# EAGLE design Robot v4 (EAGLE 9.2.1)
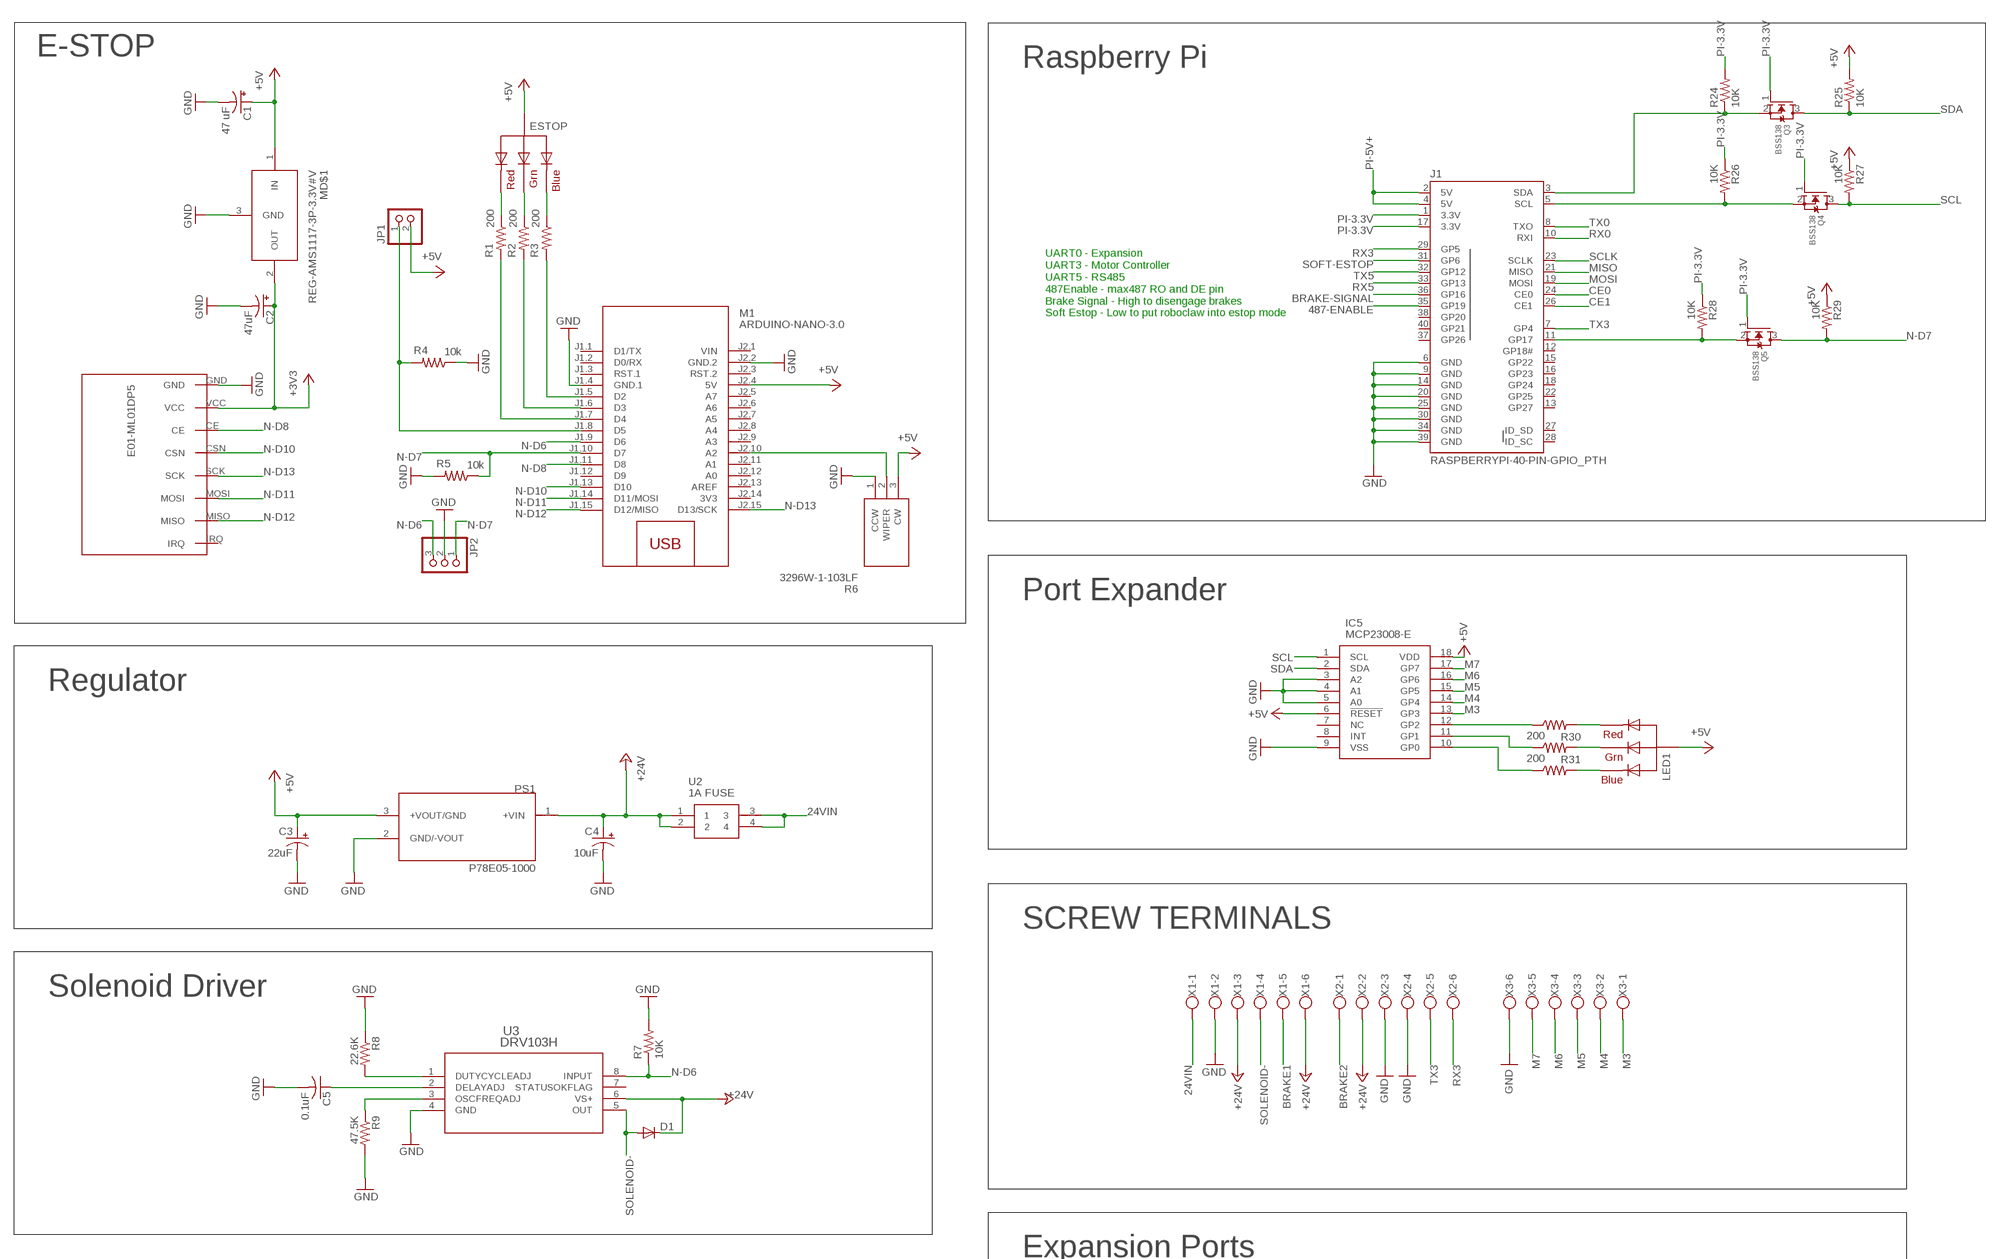
[diagram p0: schematic, sheet 1, part 1 of 2]
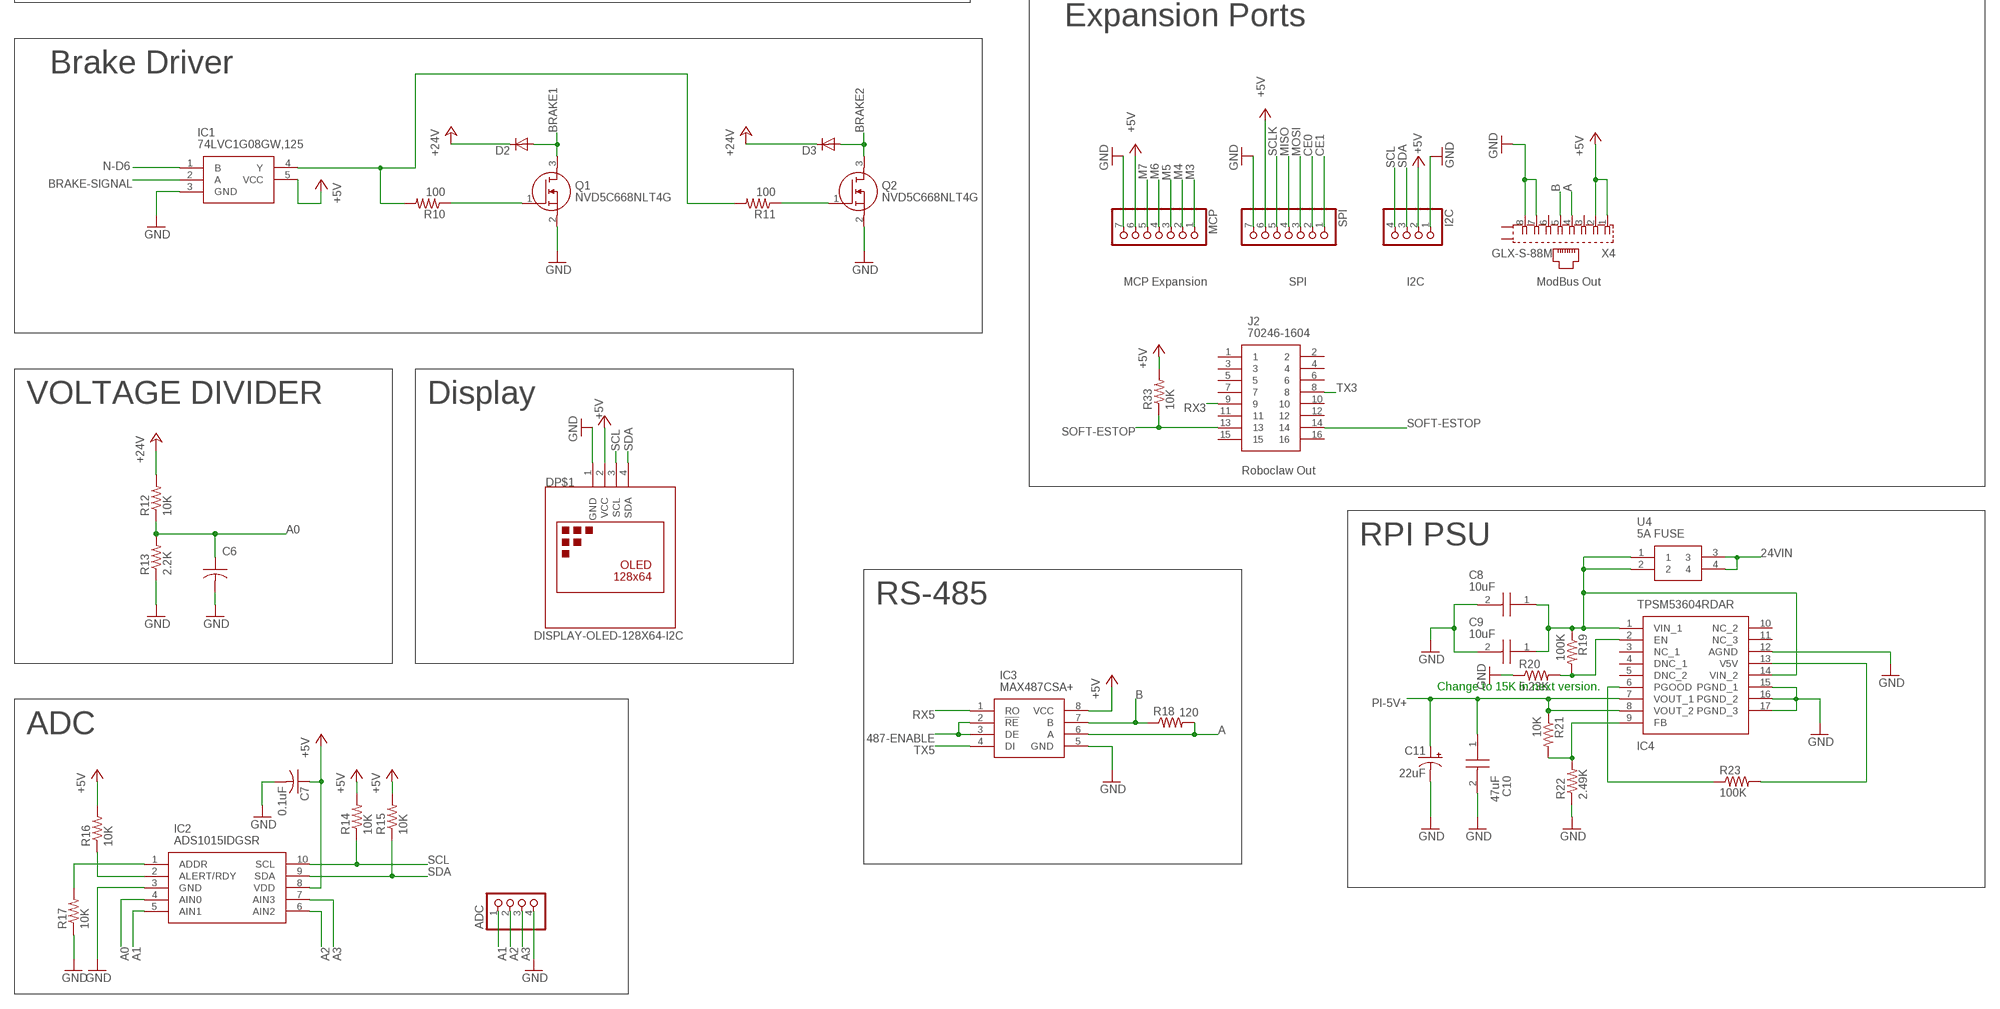
[diagram p1: schematic, sheet 1, part 2 of 2]

## Parts
ADC  PINHD-1X4  [1X04]
C1  47 uF  CPOL-USE2.5-5  [E2,5-5]
C2  47uF  CPOL-USE2.5-5  [E2,5-5]
C3  22uF  CPOL-USE3.5-8  [E3,5-8]
C4  10uF  CPOL-USE3.5-8  [E3,5-8]
C5  0.1uF  C-USC0805  [C0805]
C6  0.01uF  C-USC0805  [C0805]
C7  0.1uF  C-USC0805  [C0805]
C8  10uF  GRT31CR61H106ME01L  [CAPC3216X180N]
C9  10uF  GRT31CR61H106ME01L  [CAPC3216X180N]
C10  47uF  GRM21BR61A476ME15L  [CAPC2012X145N]
C11  22uF  CPOL-USE3.5-8  [E3,5-8]
D1  DIODESOD-123  [SOD-123]
D2  DIODESOD-123  [SOD-123]
D3  DIODESOD-123  [SOD-123]
DP$1  DISPLAY-OLED-128X64-I2C  [DISPLAY-OLED-128X64-I2C]
ESTOP  RGBLED_CA-5MM  [LED5MMRGB]
I2C  PINHD-1X4  [1X04]
IC1  74LVC1G08GW,125  [SOT65P212X110-5N]
IC2  ADS1015IDGSR  [SOP50P490X110-10N]
IC3  MAX487CSA+  [SOIC127P600X175-8N]
IC4  TPSM53604RDAR  [TPSM53604RDAR]
IC5  MCP23008-E  MCP23008-E_SO  [SOIC127P1030X265-18N]
J1  RASPBERRYPI-40-PIN-GPIO_PTH  [2X20_SHROUDED]
J2  70246-1604  [SHDR16W64P254_2X8_2794X889X947]
JP1  PINHD-1X2  [1X02]
JP2  PINHD-1X3  [1X03]
LED1  RGBLED_CA-5MM  [LED5MMRGB]
M1  ARDUINO-NANO-3.0  [ARDUINO-NANO-3.0]
MCP  PINHD-1X7  [1X07]
MD$1  REG-AMS1117-3P-3.3V#V  [REG-AMS1117-3P#V]
MD$2  E01-ML01DP5  [E01-ML01DP5]
PS1  P78E05-1000  [CONV_P78E05-1000]
Q1  NVD5C668NLT4G  [DPAK_(SINGLE-GAUGE)_TO-252(369]
Q2  NVD5C668NLT4G  [DPAK_(SINGLE-GAUGE)_TO-252(369]
Q3  BSS138  MOSFET-NREFLOW  [SOT23]
Q4  BSS138  MOSFET-NREFLOW  [SOT23]
Q5  BSS138  MOSFET-NREFLOW  [SOT23]
R1  200  R-US_M0805  [M0805]
R2  200  R-US_M0805  [M0805]
R3  200  R-US_M0805  [M0805]
R4  10k  R-US_M0805  [M0805]
R5  10k  R-US_M0805  [M0805]
R6  3296W-1-103LF  [SHDR3W54P0X254_1X3_953X483X115]
R7  10K  R-US_M0805  [M0805]
R8  22.6K  R-US_M0805  [M0805]
R9  47.5K  R-US_M0805  [M0805]
R10  100  R-US_M0805  [M0805]
R11  100  R-US_M0805  [M0805]
R12  10K  R-US_M0805  [M0805]
R13  2.2K  R-US_M0805  [M0805]
R14  10K  R-US_R0805  [R0805]
R15  10K  R-US_R0805  [R0805]
R16  10K  R-US_R0805  [R0805]
R17  10K  R-US_R0805  [R0805]
R18  120  R-US_R0805  [R0805]
R19  100K  R-US_R0805  [R0805]
R20  5.23K  R-US_R0805  [R0805]
R21  10K  R-US_R0805  [R0805]
R22  2.49K  R-US_R0805  [R0805]
R23  100K  R-US_R0805  [R0805]
R24  10K  R-US_R0805  [R0805]
R25  10K  R-US_R0805  [R0805]
R26  10K  R-US_R0805  [R0805]
R27  10K  R-US_R0805  [R0805]
R28  10K  R-US_R0805  [R0805]
R29  10K  R-US_R0805  [R0805]
R30  200  R-US_M0805  [M0805]
R31  200  R-US_M0805  [M0805]
R32  200  R-US_M0805  [M0805]
R33  10K  R-US_R0805  [R0805]
SPI  PINHD-1X7  [1X07]
U2  1A FUSE  3568  [3568]
U3  DRV103H  [DDA8]
U4  5A FUSE  3568  [3568]
X1  W237-136  [W237-136]
X2  W237-136  [W237-136]
X3  W237-136  [W237-136]
X4  GLX-S-88M  [GLX-S-88M]

## Nets
24VIN: U2.3 U2.4 U4.3 U4.4 X1.1
487-ENABLE: IC3.2(!RE) IC3.3(DE) J1.35(GP19)
+3V3: C2.+ MD$1.2(OUT) MD$2.VCC
+5V: C1.+ C3.+ C7.1 DP$1.2(VCC) ESTOP.2(VCC) I2C.2 IC1.5(VCC) IC2.8(VDD) IC3.8(VCC) IC5.6(!RESET) IC5.18(VDD) JP1.2 LED1.2(VCC) M1.J2.4(5V) MCP.6 MD$1.1(IN) PS1.3(+VOUT/GND) R6.3(CW) R14.2 R15.2 R16.2 R25.2 R27.1 R29.1 R33.2 SPI.6 X4.1 X4.2
+24V [Power]: C4.+ D1.C D2.C D3.C PS1.1(+VIN) R12.2 U2.1 U2.2 U3.6(VS+) X1.3 X1.6 X2.2
A: IC3.6(A) R18.2 X4.4
A0: C6.1 IC2.4(AIN0) R12.1 R13.2
A1: ADC.1 IC2.5(AIN1)
A2: ADC.2 IC2.6(AIN2)
A3: ADC.3 IC2.7(AIN3)
B: IC3.7(B) R18.1 X4.5
BRAKE1 [Power]: D2.A Q1.3(D) X1.5
BRAKE2 [Power]: D3.A Q2.3(D) X2.1
BRAKE-SIGNAL: IC1.2(A) J1.36(GP16)
CE0: J1.24(CE0) SPI.2
CE1: J1.26(CE1) SPI.1
GND: ADC.4 C1.- C2.- C3.- C4.- C5.2 C6.2 C7.2 C8.2 C9.2 C10.2 C11.- DP$1.1(GND) I2C.1 IC1.3(GND) IC2.3(GND) IC3.5(GND) IC4.12(AGND) IC4.15(PGND_1) IC4.16(PGND_2) IC4.17(PGND_3) IC5.3(A2) IC5.4(A1) IC5.5(A0) IC5.9(VSS) J1.6(GND) J1.9(GND) J1.14(GND) J1.20(GND) J1.25(GND) J1.30(GND) J1.34(GND) J1.39(GND) JP2.2 M1.J1.4(GND.1) M1.J2.2(GND.2) MCP.7 MD$1.3(GND) MD$2.GND PS1.2(GND/-VOUT) Q1.2(S) Q2.2(S) R4.1 R5.2 R6.1(CCW) R7.2 R8.1 R9.2 R13.1 R17.1 R20.1 R22.1 SPI.7 U3.4(GND) X1.2 X2.3 X2.4 X3.6 X4.7 X4.8
M3: IC5.13(GP3) MCP.1 X3.1
M4: IC5.14(GP4) MCP.2 X3.2
M5: IC5.15(GP5) MCP.3 X3.3
M6: IC5.16(GP6) MCP.4 X3.4
M7: IC5.17(GP7) MCP.5 X3.5
MISO: J1.21(MISO) SPI.4
MOSI: J1.19(MOSI) SPI.3
N$2: IC5.12(GP2) R30.1
N$3: IC5.11(GP1) R31.1
N$4 [Power]: C8.1 C9.1 IC4.1(VIN_1) IC4.14(VIN_2) R19.1 U4.1 U4.2
N$5: IC1.4(Y) R10.2 R11.2
N$6: J1.5(SCL) Q4.2(S) R26.2
N$7: Q2.1(G) R11.1
N$8: Q1.1(G) R10.1
N$9: J1.3(SDA) Q3.2(S) R24.1
N$12: IC5.10(GP0) R32.1
N$13: IC4.2(EN) R19.2 R20.2
N$14: IC4.9(FB) R21.2 R22.2
N$15: J1.11(GP17) Q5.2(S) R28.2
N$16: IC4.13(V5V) R23.2
N$17: IC4.6(PGOOD) R23.1
N$20: IC2.2(ALERT/RDY) R16.1
N$21: IC2.1(ADDR) R17.2
N$34: LED1.1(RED) R30.2
N$35: LED1.3(GREEN) R31.2
N$36: LED1.4(BLUE) R32.2
N$37: ESTOP.4(BLUE) R3.1
N$38: ESTOP.3(GREEN) R2.1
N$39: ESTOP.1(RED) R1.1
N$40: M1.J1.5(D2) R3.2
N$41: JP1.1 M1.J1.8(D5) R4.2
N$42: M1.J1.6(D3) R2.2
N$43: M1.J1.7(D4) R1.2
N$44: M1.J2.10(A2) R6.2(WIPER)
N$53: C5.1 U3.2(DELAYADJ)
N$55: R9.1 U3.3(OSCFREQADJ)
N$57: R8.2 U3.1(DUTYCYCLEADJ)
N-D6: IC1.1(B) JP2.3 M1.J1.9(D6) R7.1 U3.8(INPUT)
N-D7: JP2.1 M1.J1.10(D7) Q5.3(D) R5.1 R29.2
N-D8: M1.J1.11(D8) MD$2.CE
N-D10: M1.J1.13(D10) MD$2.CSN
N-D11: M1.J1.14(D11/MOSI) MD$2.MOSI
N-D12: M1.J1.15(D12/MISO) MD$2.MISO
N-D13: M1.J2.15(D13/SCK) MD$2.SCK
PI-3.3V: J1.1(3.3V) J1.17(3.3V) Q3.1(G) Q4.1(G) Q5.1(G) R24.2 R26.1 R28.1
PI-5V+: C10.1 C11.+ IC4.7(VOUT_1) IC4.8(VOUT_2) J1.2(5V) J1.4(5V) R21.1
RX0: J1.10(RXI)
RX3: J1.29(GP5) J2.9 X2.6
RX5: IC3.1(RO) J1.33(GP13)
SCL: DP$1.3(SCL) I2C.4 IC2.10(SCL) IC5.1(SCL) Q4.3(D) R14.1 R27.2
SCLK: J1.23(SCLK) SPI.5
SDA: DP$1.4(SDA) I2C.3 IC2.9(SDA) IC5.2(SDA) Q3.3(D) R15.1 R25.1
SOFT-ESTOP: J1.31(GP6) J2.13 J2.14 R33.1
SOLENOID- [Power]: D1.A U3.5(OUT) X1.4
TX0: J1.8(TXO)
TX3: J1.7(GP4) J2.8 X2.5
TX5: IC3.4(DI) J1.32(GP12)
Unconnected: IC4.3(NC_1) IC4.4(DNC_1) IC4.5(DNC_2) IC4.10(NC_2) IC4.11(NC_3) IC5.7(NC) IC5.8(INT) J1.12(GP18#) J1.13(GP27) J1.15(GP22) J1.16(GP23) J1.18(GP24) J1.22(GP25) J1.27(ID_SD) J1.28(ID_SC) J1.37(GP26) J1.38(GP20) J1.40(GP21) J2.1 J2.2 J2.3 J2.4 J2.5 J2.6 J2.7 J2.10 J2.11 J2.12 J2.15 J2.16 M1.J1.1(D1/TX) M1.J1.2(D0/RX) M1.J1.3(RST.1) M1.J1.12(D9) M1.J2.3(RST.2) M1.J2.5(A7) M1.J2.6(A6) M1.J2.7(A5) M1.J2.8(A4) M1.J2.9(A3) M1.J2.11(A1) M1.J2.12(A0) M1.J2.13(AREF) MD$2.IRQ U3.7(STATUSOKFLAG) X4.3 X4.6 X4.S1 X4.S2

## Notes on the sheet
- E-STOP
- Raspberry Pi
- UART0 - Expansion
  UART3 - Motor Controller
  UART5 - RS485
  487Enable - max487 RO and DE pin
  Brake Signal - High to disengage brakes
  Soft Estop - Low to put roboclaw into estop mode
- Port Expander
- Regulator
- SCREW TERMINALS
- Solenoid Driver
- Expansion Ports
- Brake Driver
- MCP Expansion | SPI | I2C | ModBus Out
- VOLTAGE DIVIDER | Display
- Roboclaw Out
- RPI PSU
- RS-485
- Change to 15K in next version.
- ADC

## Power pins joined to a net without a drawn wire
3V3: M1.J2.14(3V3)
VIN: M1.J2.1(VIN)

## Library data of the parts
ADC I2C = pinhead:PINHD-1X4: PIN HEADER
C1-C4 C11 = rcl:CPOL-US: POLARIZED CAPACITOR, American symbol; SPICEPREFIX: C
C5-C7 = adafruit:C-US: CAPACITOR, American symbol
C8 C9 = SamacSys_Parts:GRT31CR61H106ME01L: Murata 10uF Multilayer Ceramic Capacitor MLCC 50V dc +/-20% X5R Dielectric 1206 SMD, Max. Temp. +85C Source: Datasheet <https://componentsearchengine.com/Datasheets/1/GRT31CR61H106ME01L.pdf>; DESCRIPTION: Murata 10uF Multilayer Ceramic Capacitor MLCC 50V dc +/-20% X5R Dielectric 1206 SMD, Max. Temp. +85C; HEIGHT: 1.8mm; MANUFACTURER_NAME: Murata Electronics; MANUFACTURER_PART_NUMBER: GRT31CR61H106ME01L; MOUSER_PART_NUMBER: 81-GRT31CR61H106ME1L; MOUSER_PRICE-STOCK: https://www.mouser.com/Search/Refine.aspx?Keyword=81-GRT31CR61H106ME1L
C10 = SamacSys_Parts:GRM21BR61A476ME15L: Multilayer Ceramic Capacitors MLCC - SMD/SMT 0805 47uF 10volts *Derate Voltage/Temp Source: Datasheet <https://componentsearchengine.com/Datasheets/1/GRM21BR61A476ME15L.pdf>; DESCRIPTION: Multilayer Ceramic Capacitors MLCC - SMD/SMT 0805 47uF 10volts *Derate Voltage/Temp; HEIGHT: 1.45mm; MANUFACTURER_NAME: Murata Electronics; MANUFACTURER_PART_NUMBER: GRM21BR61A476ME15L; MOUSER_PART_NUMBER: 81-GRM21BR61A476ME5L; MOUSER_PRICE-STOCK: https://www.mouser.com/Search/Refine.aspx?Keyword=81-GRM21BR61A476ME5L
D1-D3 = adafruit:DIODE: Diode SMADIODE - SMA Surface Mount Package 20V 1A Schottky Diode Digikey: 641-1014-6-ND DO-1N4148 - Through Hole Small Current Diode SOD-123 20V 1 A (.5mV Vf) Schottky Diode - Digikey: MBRX120TPMSCT-ND SOD-323 10V 570mA (.38mV Vf, 3ns) Schottky Diode - Digikey: ZLLS410CT-ND SOD-523 30V 30mA Schottky Diode (RB751S-40TE61) - Digikey: RB751S-40TE61CT-ND SOT23-R/W - SOT23 Package (R = Solder Paste/Reflow Ovens, W = Hand-Soldering) BAT54Film 40V 300mA - Digikey: 497-7162-1-ND
DP$1 = diy-modules:DISPLAY-OLED-128X64-I2C: 128x64 Dot Matrix OLED Module based on SSD1306 chip Variant with I2C interface More details available here: http://www.instructables.com/id/Monochrome-096-i2c-OLED-display-with-arduino-SSD13/ SSD1306 datasheet: https://cdn-shop.adafruit.com/datasheets/SSD1306.pdf Click here to find device on ebay.com <http://www.ebay.com/sch/oled+display+128x64+iic> Note: There are two variants: I2C and SPI. Search for the proper version.
ESTOP LED1 = adafruit:RGBLED_CA: RGB LED, common-anode 5MM Staggered pins 5mm Piranha package http://www.ladyada.net/library/pcb/eaglelibrary.html
IC1 = SamacSys_Parts:74LVC1G08GW,125: 74LVC1G08GW,125, Logic Gate 2 Input AND, LVC, 32mA 1.65 to 5.5V 5-Pin TSSOP Source: Datasheet <https://componentsearchengine.com/Datasheets/1/74LVC1G08GW,125.pdf>; DESCRIPTION: 74LVC1G08GW,125, Logic Gate 2 Input AND, LVC, 32mA 1.65 to 5.5V 5-Pin TSSOP; HEIGHT: 1.1mm; MANUFACTURER_NAME: Nexperia; MANUFACTURER_PART_NUMBER: 74LVC1G08GW,125; MOUSER_PART_NUMBER: 771-74LVC1G08GW-G; MOUSER_PRICE-STOCK: https://www.mouser.com/Search/Refine.aspx?Keyword=771-74LVC1G08GW-G
IC2 = SamacSys_Parts:ADS1015IDGSR: 12-Bit, 3.3kSPS, 4-Ch Delta-Sigma ADC With PGA, Oscillator, VREF, Comparator and I2C Interface Source: Datasheet <http://www.ti.com/lit/gpn/ADS1015>; DESCRIPTION: 12-Bit, 3.3kSPS, 4-Ch Delta-Sigma ADC With PGA, Oscillator, VREF, Comparator and I2C Interface; HEIGHT: 1.1mm; MANUFACTURER_NAME: Texas Instruments; MANUFACTURER_PART_NUMBER: ADS1015IDGSR; MOUSER_PART_NUMBER: 595-ADS1015IDGSR; MOUSER_PRICE-STOCK: https://www.mouser.com/Search/Refine.aspx?Keyword=595-ADS1015IDGSR
IC3 = SamacSys_Parts:MAX487CSA+: MAX487CSA+, Line Transceiver, RS-485, RS-422 Differential, 5V, 8-Pin SOIC Source: Datasheet <https://componentsearchengine.com/Datasheets/1/MAX487CSA .pdf>; DESCRIPTION: MAX487CSA+, Line Transceiver, RS-485, RS-422 Differential, 5V, 8-Pin SOIC; HEIGHT: 1.75mm; MANUFACTURER_NAME: Maxim Integrated; MANUFACTURER_PART_NUMBER: MAX487CSA+; MOUSER_PART_NUMBER: 700-MAX487CSA; MOUSER_PRICE-STOCK: https://www.mouser.com/Search/Refine.aspx?Keyword=700-MAX487CSA
IC4 = SamacSys_Parts:TPSM53604RDAR: Switching Voltage Regulators 36-V, 4-A step-down power module in small 5.5 x 5 x 4mm RLF QFN package with simple footprint 15-B3QFN -40 to 125 Source: Datasheet <https://www.ti.com/lit/gpn/TPSM53604>; DESCRIPTION: Switching Voltage Regulators 36-V, 4-A step-down power module in small 5.5 x 5 x 4mm RLF QFN package with simple footprint 15-B3QFN -40 to 125; HEIGHT: 4.1mm; MANUFACTURER_NAME: Texas Instruments; MANUFACTURER_PART_NUMBER: TPSM53604RDAR; MOUSER_PART_NUMBER: 595-TPSM53604RDAR; MOUSER_PRICE-STOCK: https://www.mouser.com/Search/Refine.aspx?Keyword=595-TPSM53604RDAR
IC5 = SamacSys_Parts:MCP23008-E_SO: 8-bit I/O Expander,I2C,MCP23008-E/SO Source: Datasheet <https://componentsearchengine.com/Datasheets/1/MCP23008-E_SO.pdf>; DESCRIPTION: 8-bit I/O Expander,I2C,MCP23008-E/SO; HEIGHT: 2.65mm; MANUFACTURER_NAME: Microchip; MANUFACTURER_PART_NUMBER: MCP23008-E/SO; MOUSER_PART_NUMBER: 579-MCP23008-E/SO; MOUSER_PRICE-STOCK: https://www.mouser.com/Search/Refine.aspx?Keyword=579-MCP23008-E%2FSO
J1 = SparkFun-Connectors:RASPBERRYPI-40-PIN-GPIO: Raspberry Pi GPIO Header 2x20 pin connector, as found on B, B+, A+ models. Both shrouded PTH and SMT versions available. SparkFun Products: GPIO Shrouded Header <https://www.sparkfun.com/products/13054>- PTH SparkFun Pi Wedge (Preassembled) <https://www.sparkfun.com/products/13717>; PROD_ID: CONN-12263; SF_ID: PRT-13054
J2 = SamacSys_Parts:70246-1604: Molex C-GRID 70246, 2.54mm Pitch, 16 Way, 2 Row, Straight PCB Header, Through Hole Source: Datasheet <https://componentsearchengine.com/Datasheets/1/70246-1604.pdf>; DESCRIPTION: Molex C-GRID 70246, 2.54mm Pitch, 16 Way, 2 Row, Straight PCB Header, Through Hole; HEIGHT: 9.47mm; MANUFACTURER_NAME: Molex; MANUFACTURER_PART_NUMBER: 70246-1604; MOUSER_PART_NUMBER: 538-70246-1604; MOUSER_PRICE-STOCK: https://www.mouser.com/Search/Refine.aspx?Keyword=538-70246-1604
JP1 = pinhead:PINHD-1X2: PIN HEADER
JP2 = adafruit:PINHD-1X3: PIN HEADER
M1 = diy-modules:ARDUINO-NANO-3.0: Arduino Nano 3.0 and compatible devices More details available here: https://www.arduino.cc/en/Main/ArduinoBoardNano Click here to find device on ebay.com <http://www.ebay.com/sch/arduino+nano>
MCP SPI = pinhead:PINHD-1X7: PIN HEADER
MD$1 = diy-modules:REG-AMS1117-3P-*: Linear Regulator based on AMS1117 chip 3-pin version AMS1117 datasheet is available here: http://www.advanced-monolithic.com/pdf/ds1117.pdf Click here to find device on ebay.com <http://www.ebay.com/sch/ams1117+module> Note: There are many variants. Search for the proper version.
MD$2 = MyLibrary:E01-ML01DP5
PS1 = P78E05-1000:P78E05-1000: NON-ISOLATED DC SWITCHING REGULATOR; MANUFACTURER: CUI Inc; STANDARD: Manufacturer Recommendations
Q1 Q2 = SamacSys_Parts:NVD5C668NLT4G: Power MOSFET 60V, 49 A, 8.9 mOhm, Single N-Channel, DPAK, Logic Level. DPAK 2500 tape and reel Source: Datasheet <https://componentsearchengine.com/Datasheets/1/NVD5C668NLT4G.pdf>; DESCRIPTION: Power MOSFET 60V, 49 A, 8.9 mOhm, Single N-Channel, DPAK, Logic Level. DPAK 2500 tape and reel; HEIGHT: mm; MANUFACTURER_NAME: ON Semiconductor; MANUFACTURER_PART_NUMBER: NVD5C668NLT4G; MOUSER_PART_NUMBER: 863-NVD5C668NLT4G; MOUSER_PRICE-STOCK: https://www.mouser.com/Search/Refine.aspx?Keyword=863-NVD5C668NLT4G
Q3-Q5 = adafruit:MOSFET-N: N-Channel Mosfet 2N7002E - 60V 260mA SOT23 [Digikey: 2N7002ET1GOSTR-ND] - REEL BSH103 - 30V 850mA SOT23 [Digikey: 568-5013-1-ND]
R1-R5 R7-R33 = adafruit:R-US_: RESISTOR, American symbol
R6 = 3296W-1-103LF:3296W-1-103LF: Bourns 3296W Series 25-Turn Through Hole Cermet Trimmer Resistor with Pin Terminations, 10000???? ????10% 1/2W ????100ppm/????C Source: Datasheet <https://componentsearchengine.com/Datasheets/1/3296W-1-103LF.pdf>; DESCRIPTION: Bourns 3296W Series 25-Turn Through Hole Cermet Trimmer Resistor with Pin Terminations, 10000???? ????10% 1/2W ????100ppm/????C; HEIGHT: 11.55mm; MANUFACTURER_NAME: Bourns; MANUFACTURER_PART_NUMBER: 3296W-1-103LF; MOUSER_PART_NUMBER: 652-3296W-1-103LF; MOUSER_PRICE-STOCK: https://www.mouser.com/Search/Refine.aspx?Keyword=652-3296W-1-103LF
U2 U4 = SamacSys_Parts:3568: Fuse Holder .63 MINI FUSE HOLDER Source: Datasheet <https://componentsearchengine.com/Datasheets/1/3568.pdf>; DESCRIPTION: Fuse Holder .63 MINI FUSE HOLDER; HEIGHT: 7.37mm; MANUFACTURER_NAME: Keystone Electronics; MANUFACTURER_PART_NUMBER: 3568; MOUSER_PART_NUMBER: 534-3568; MOUSER_PRICE-STOCK: https://www.mouser.com/Search/Refine.aspx?Keyword=534-3568
U3 = MyLibrary:DRV103H; MANUFACTURER_PART_NUMBER: DRV103H; VENDOR: Texas Instruments
X1-X3 = con-wago-500:W237-136: WAGO SCREW CLAMP; MPN: 237-136; OC_FARNELL: unknown; OC_NEWARK: 84K9151
X4 = con-kycon:GLX-S-88M: Mod. Jack, Right Angle, 8 posiotion, 8 contatcs RJ45 Source: GLX-S-88M.pdf; OC_FARNELL: unknown; OC_NEWARK: unknown

## Net classes
0 default: width 0.305 mm, drill 0.508 mm, clearance 0.127 mm
1 Power: width 1.27 mm, drill 0.508 mm, clearance 0.381 mm

## Board
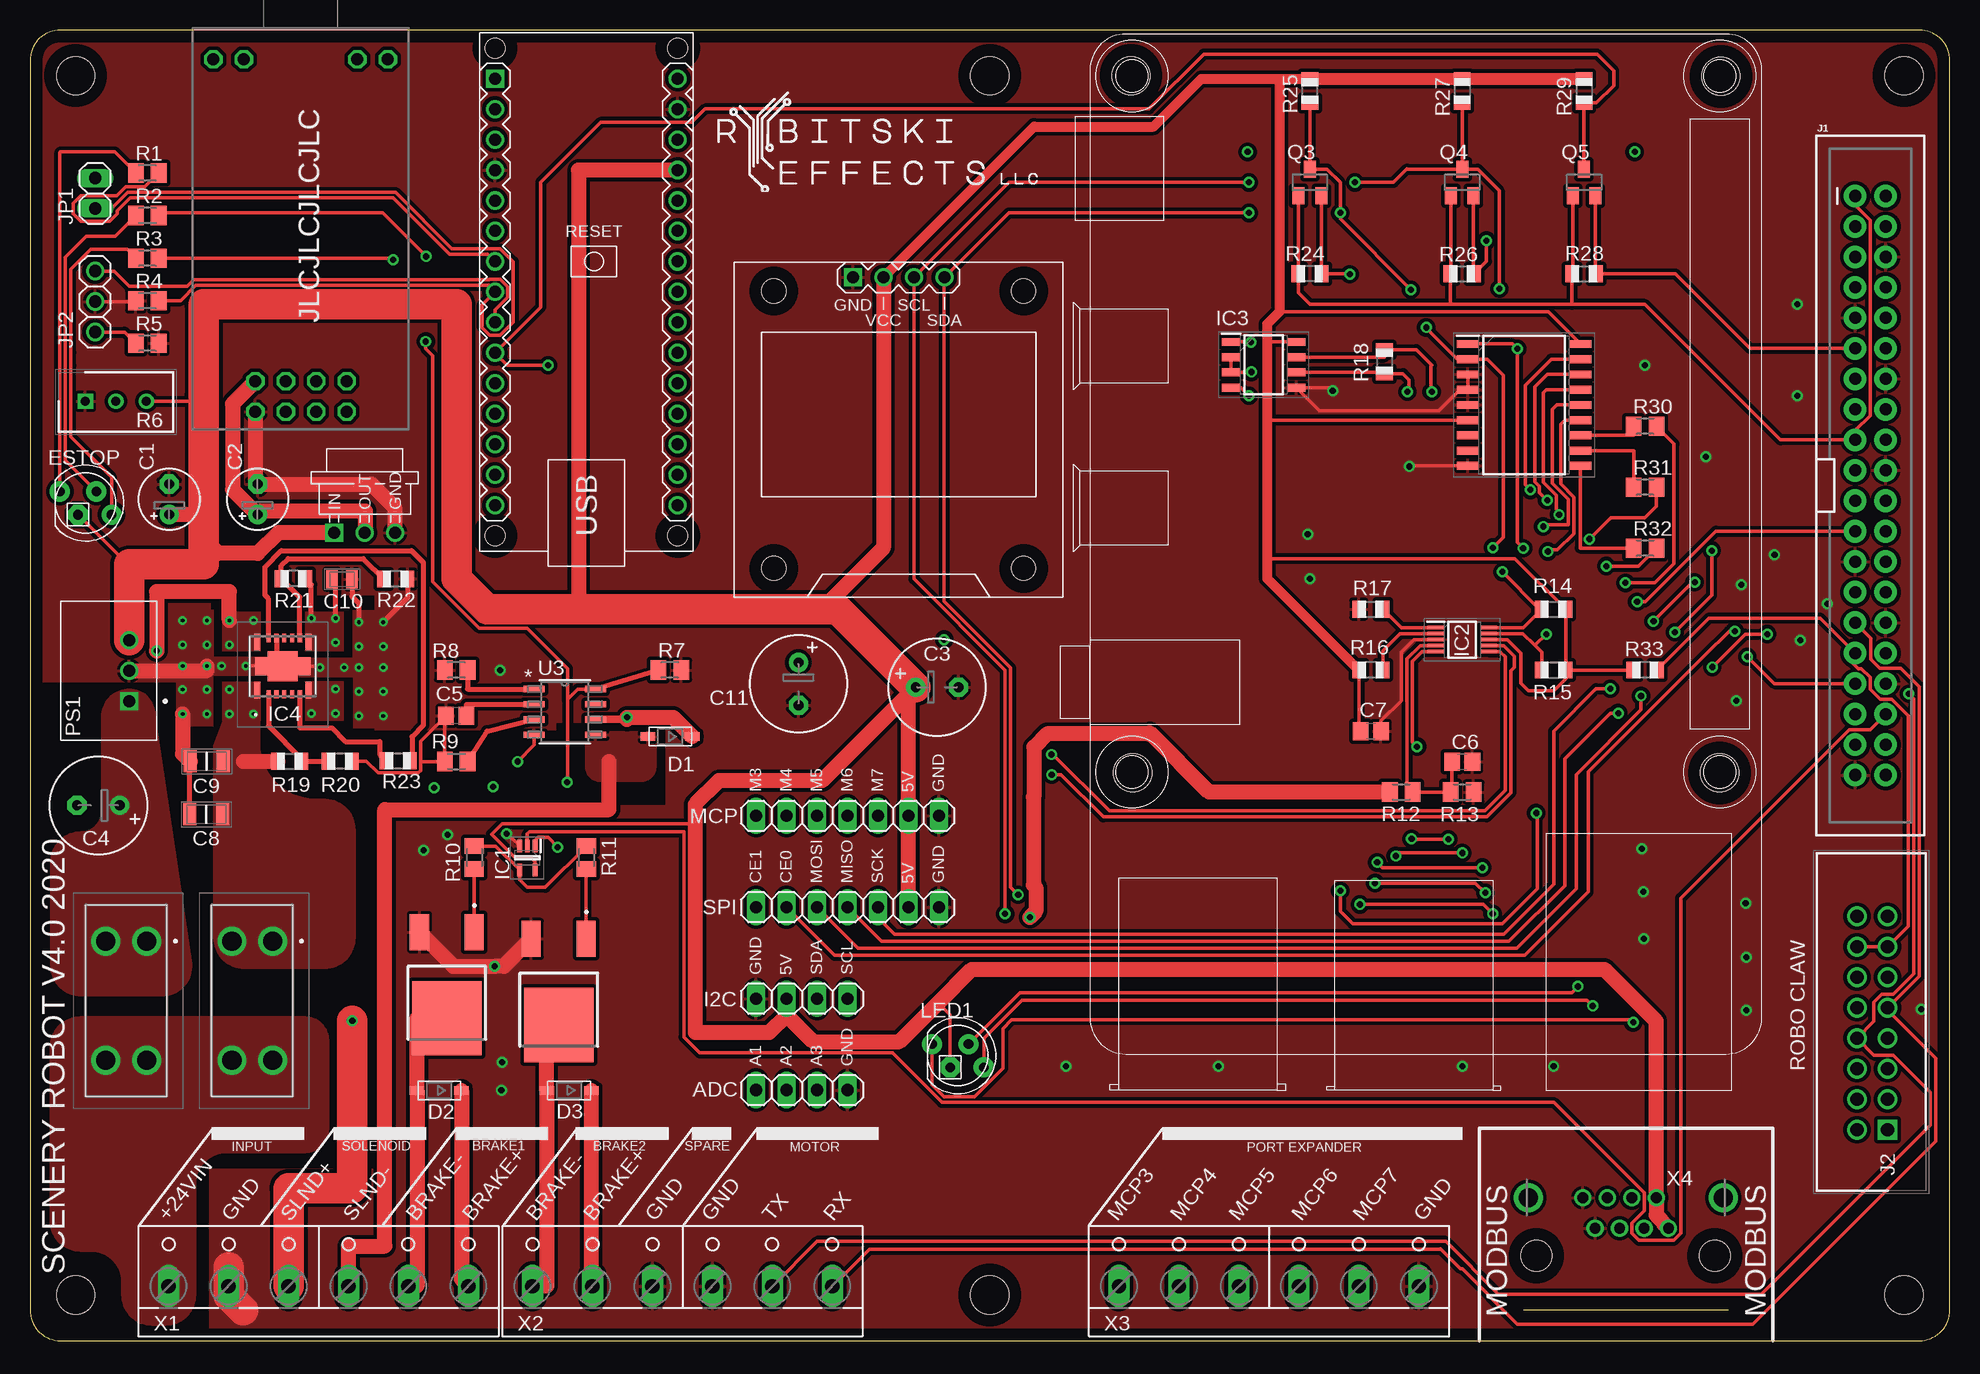
[diagram p2: board, top side]
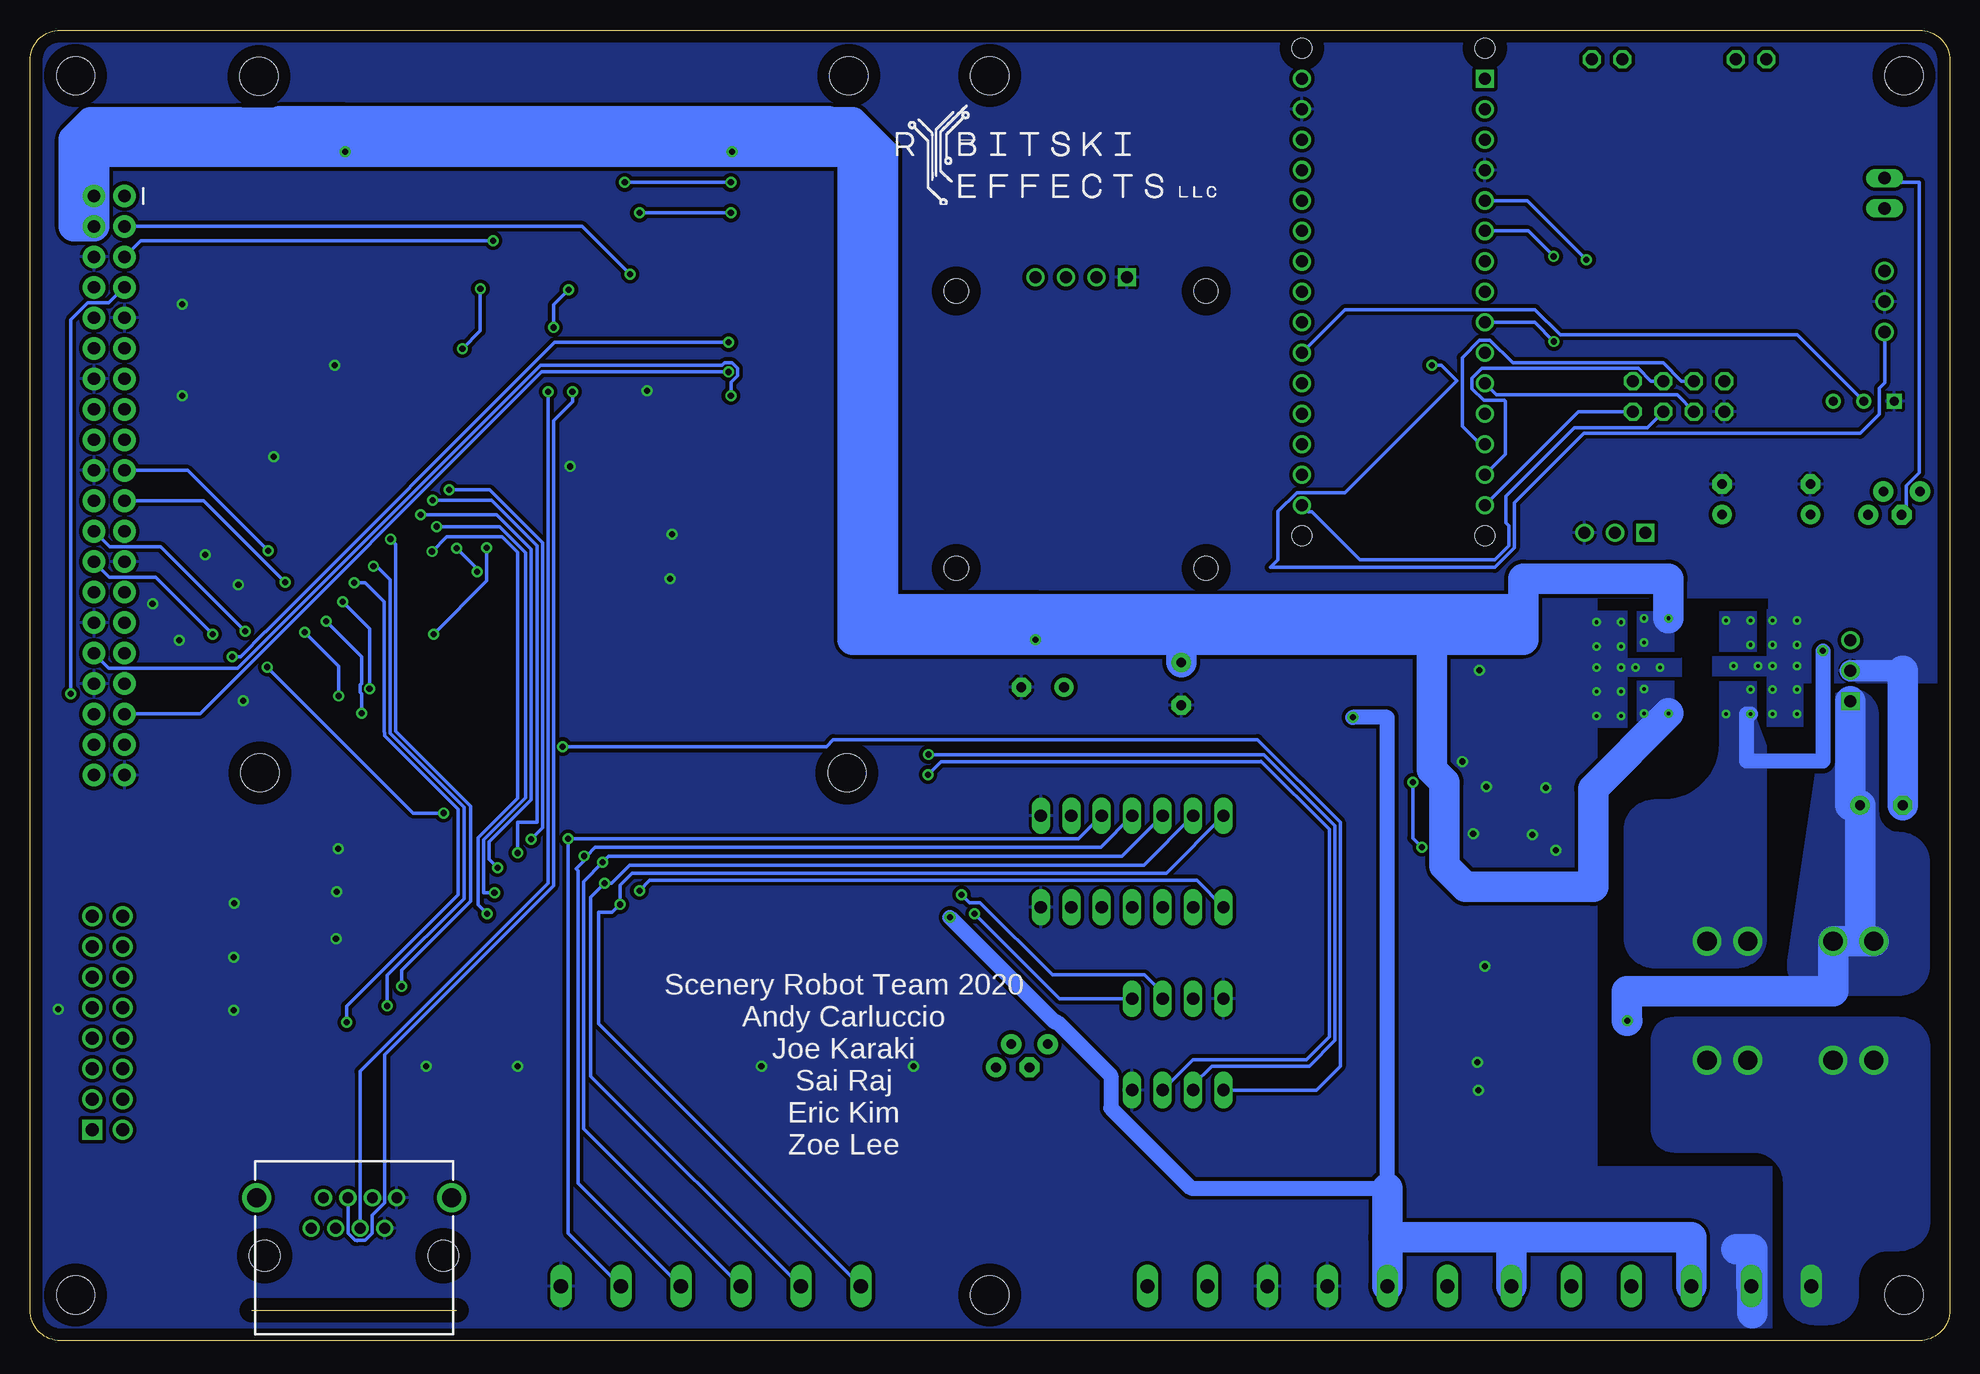
[diagram p3: board, bottom side, seen from below]

Size 160.02 x 109.22 mm. Coordinates in mm from the lower left corner, seen from the top.
Outline: 0,106.68 0,2.54 arc90 2.54,0 157.48,0 arc90 160.02,2.54 160.02,106.68 arc90 157.48,109.22 2.54,109.22 arc90 0,106.68
Copper layers (1*16): Top 0.035mm / dielectric 1.5mm / Bottom 0.035mm
Design rules "default": minimum track width 6mil, minimum drill 0.35mm, track to track 6mil, track to pad 6mil, pad to pad 6mil, via to via 6mil, smd to smd 6mil, copper to edge 40mil, drill to drill 6mil, minimum pad ring 10mil, minimum via ring 8mil, stop-mask expansion 4mil, vias tented up to drill 0mil, thermal gap 10mil
Holes 3.17 mm at 3.81,3.81 3.81,105.41 156.21,3.81 156.21,105.41 80.01,105.41 80.01,3.81 140.94,105.36 91.77,105.41 91.92,47.32 140.84,47.32

### Footprints (pad centres in the part's own frame; a part is rotated, then mirrored left to right if it is on the bottom)
1X04 = drill 1.016 long: 1 -3.81,0; 2 -1.27,0; 3 1.27,0; 4 3.81,0
E2,5-5 = drill 0.813 pad 1.6: + -1.27,0 | drill 0.813 pad 1.6 octagon: - 1.27,0
E3,5-8 = drill 0.813 pad 1.6: + -1.778,0 | drill 0.813 pad 1.6 octagon: - 1.778,0
C0805 = smd 1.3 x 1.5: 1 -0.85,0; 2 0.85,0
CAPC3216X180N = smd 1.07 x 1.82: 1 -1.38,0; 2 1.38,0
CAPC2012X145N = smd 0.97 x 1.47: 1 -0.83,0; 2 0.83,0
SOD-123 = smd 1.2 x 0.7: A 1.85,0; C -1.85,0
DISPLAY-OLED-128X64-I2C = drill 1 square: 1 -3.81,12.7 | drill 1: 2 -1.27,12.7; 3 1.27,12.7; 4 3.81,12.7 | hole 2: -10.414,11.557; 10.414,11.557; 10.414,-11.557; -10.414,-11.557
LED5MMRGB = drill 0.8 pad 1.676: 1 -2.159,0.968; 3 0.889,0.968; 4 2.159,-0.968 | drill 0.8 pad 1.676 octagon: 2 -0.635,-0.968
SOT65P212X110-5N = smd 1.05 x 0.4: 1 -1,0.65; 2 -1,0; 3 -1,-0.65; 4 1,-0.65; 5 1,0.65
SOP50P490X110-10N = smd 1.4 x 0.3: 1 -2.2,1; 2 -2.2,0.5; 3 -2.2,0; 4 -2.2,-0.5; 5 -2.2,-1; 6 2.2,-1; 7 2.2,-0.5; 8 2.2,0; 9 2.2,0.5; 10 2.2,1
SOIC127P600X175-8N = smd 1.525 x 0.65: 1 -2.712,1.905; 2 -2.712,0.635; 3 -2.712,-0.635; 4 -2.712,-1.905; 5 2.712,-1.905; 6 2.712,-0.635; 7 2.712,0.635; 8 2.712,1.905
TPSM53604RDAR = smd 1.4 x 0.5: 1 0,2.155; 7 0,-2.145; 8 4,-2.145; 14 4,2.155 | smd 0.7 x 0.35: 2 -0.35,1.18; 3 -0.35,0.53; 4 -0.35,-0.12; 5 -0.35,-0.77; 6 -0.35,-1.42; 9 4.35,-1.42; 10 4.35,-0.77; 11 4.35,-0.12; 12 4.35,0.53; 13 4.35,1.18 | smd 2.5 x 2.5: 15 2,0 | smd 1.5 x 1.05: 16 2,1.775; 17 2,-1.775
SOIC127P1030X265-18N = smd 1.85 x 0.65: 1 -4.675,5.08; 2 -4.675,3.81; 3 -4.675,2.54; 4 -4.675,1.27; 5 -4.675,0; 6 -4.675,-1.27; 7 -4.675,-2.54; 8 -4.675,-3.81; 9 -4.675,-5.08; 10 4.675,-5.08; 11 4.675,-3.81; 12 4.675,-2.54; 13 4.675,-1.27; 14 4.675,0; 15 4.675,1.27; 16 4.675,2.54; 17 4.675,3.81; 18 4.675,5.08
2X20_SHROUDED = drill 1.016 pad 1.88: 1 -1.27,24.13; 2 1.27,24.13; 3 -1.27,21.59; 4 1.27,21.59; 5 -1.27,19.05; 6 1.27,19.05; 7 -1.27,16.51; 8 1.27,16.51; 9 -1.27,13.97; 10 1.27,13.97; 11 -1.27,11.43; 12 1.27,11.43; 13 -1.27,8.89; 14 1.27,8.89; 15 -1.27,6.35; 16 1.27,6.35; 17 -1.27,3.81; 18 1.27,3.81; 19 -1.27,1.27; 20 1.27,1.27; 21 -1.27,-1.27; 22 1.27,-1.27; 23 -1.27,-3.81; 24 1.27,-3.81; 25 -1.27,-6.35; 26 1.27,-6.35; 27 -1.27,-8.89; 28 1.27,-8.89; 29 -1.27,-11.43; 30 1.27,-11.43; 31 -1.27,-13.97; 32 1.27,-13.97; 33 -1.27,-16.51; 34 1.27,-16.51; 35 -1.27,-19.05; 36 1.27,-19.05; 37 -1.27,-21.59; 38 1.27,-21.59; 39 -1.27,-24.13; 40 1.27,-24.13
SHDR16W64P254_2X8_2794X889X947 = drill 1.1 pad 1.65 square: 1 0,0 | drill 1.1 pad 1.65: 2 0,2.54; 3 2.54,0; 4 2.54,2.54; 5 5.08,0; 6 5.08,2.54; 7 7.62,0; 8 7.62,2.54; 9 10.16,0; 10 10.16,2.54; 11 12.7,0; 12 12.7,2.54; 13 15.24,0; 14 15.24,2.54; 15 17.78,0; 16 17.78,2.54
1X02 = drill 1.016 long: 1 -1.27,0; 2 1.27,0
1X03 = drill 1.016: 1 -2.54,0; 2 0,0; 3 2.54,0
ARDUINO-NANO-3.0 = drill 1 square: J1.1 17.78,7.62 | drill 1: J1.2 15.24,7.62; J1.3 12.7,7.62; J1.4 10.16,7.62; J1.5 7.62,7.62; J1.6 5.08,7.62; J1.7 2.54,7.62; J1.8 0,7.62; J1.9 -2.54,7.62; J1.10 -5.08,7.62; J1.11 -7.62,7.62; J1.12 -10.16,7.62; J1.13 -12.7,7.62; J1.14 -15.24,7.62; J1.15 -17.78,7.62; J2.1 17.78,-7.62; J2.2 15.24,-7.62; J2.3 12.7,-7.62; J2.4 10.16,-7.62; J2.5 7.62,-7.62; J2.6 5.08,-7.62; J2.7 2.54,-7.62; J2.8 0,-7.62; J2.9 -2.54,-7.62; J2.10 -5.08,-7.62; J2.11 -7.62,-7.62; J2.12 -10.16,-7.62; J2.13 -12.7,-7.62; J2.14 -15.24,-7.62; J2.15 -17.78,-7.62 | hole 1.651: -20.32,7.62; -20.32,-7.62; 20.32,-7.62; 20.32,7.62
1X07 = drill 1.016 long: 1 -7.62,0; 2 -5.08,0; 3 -2.54,0; 4 0,0; 5 2.54,0; 6 5.08,0; 7 7.62,0
REG-AMS1117-3P#V = drill 1 square: 1 -2.54,-5.08 | drill 1: 2 0,-5.08; 3 2.54,-5.08
E01-ML01DP5 = drill 1 octagon: CE 10.23,-1.45; CSN 10.23,-3.99; GND 12.77,-1.45; IRQ 5.15,-3.99; MISO 5.15,-1.45; MOSI 7.69,-3.99; P$9 1.73,-30.8; P$10 4.27,-30.8; P$11 13.73,-30.8; P$12 16.27,-30.8; SCK 7.69,-1.45; VCC 12.77,-3.99
CONV_P78E05-1000 = drill 1 square: 1 -2.54,0 | drill 1: 2 0,0; 3 2.54,0
DPAK_(SINGLE-GAUGE)_TO-252(369 = smd 3 x 1.6: 1 8.95,-2.285; 2 8.95,2.285 | smd 6.2 x 5.8: 3 1.77,0
SOT23 = smd 1 x 1.4: 1 -0.95,-1.1; 2 0.95,-1.1; 3 0,1.1
M0805 = smd 1.3 x 1.6: 1 -0.95,0; 2 0.95,0
SHDR3W54P0X254_1X3_953X483X115 = drill 0.75 pad 1.15 square: 1 0,0 | drill 0.75 pad 1.15: 2 -2.54,0; 3 -5.08,0
R0805 = smd 1.1 x 1.4: 1 -1,0; 2 1,0
3568 = drill 1.6 pad 2.4: 1 0,0; 2 0,-3.4; 3 9.92,0; 4 9.92,-3.4
DDA8 = smd 1.778 x 0.533: 1 -2.565,1.905; 2 -2.565,0.635; 3 -2.565,-0.635; 4 -2.565,-1.905; 5 2.565,-1.905; 6 2.565,-0.635; 7 2.565,0.635; 8 2.565,1.905
W237-136 = drill 1.194 long: 1 -12.5,-1.27; 2 -7.5,-1.27; 3 -2.5,-1.27; 4 2.5,-1.27; 5 7.5,-1.27; 6 12.5,-1.27
GLX-S-88M = drill 0.9 pad 1.422: 1 -3.57,-2.3; 2 -2.55,-4.84; 3 -1.53,-2.3; 4 -0.51,-4.84; 5 0.51,-2.3; 6 1.53,-4.84; 7 2.55,-2.3; 8 3.57,-4.84 | drill 1.6 pad 2.184: S1 -8.125,-4.84; S2 8.125,-4.84 | hole 2.55: -7.44,0; 7.44,0

### Placement (x,y rotation side)
ADC  64.34,20.88 0 top
C1  11.61,70.11 90 top
C2  18.97,70.11 90 top
C3  75.61,54.45 0 top
C4  5.7,44.61 180 top
C5  35.53,52.07 180 top
C6  119.38,48.26 0 top
C7  111.76,50.8 0 top
C8  14.7,43.85 180 top
C9  14.74,48.27 180 top
C10  26.01,63.45 0 top
C11  64.06,54.74 270 top
D1  53.37,50.34 180 top
D2  34.11,20.85 180 top
D3  44.93,20.85 180 top
DP$1  72.41,75.91 0 top
ESTOP  4.64,69.8 0 top
I2C  64.34,28.5 0 top
IC1  41.45,40.23 270 top
IC2  119.38,58.42 0 top
IC3  102.83,81.32 0 top
IC4  21.08,54.21 90 top
IC5  124.54,77.98 0 top
J1  153.41,71.26 0 top
J2  154.83,17.57 90 top
JP1  5.43,95.62 90 top
JP2  5.43,86.59 90 top
LED1  77.34,23.74 0 top
M1  46.38,87.39 90 top
MCP  68.15,43.74 0 top
MD$1  27.9,72.4 0 top
MD$2  31.56,75.97 180 top
PS1  8.27,55.83 90 top
Q1  34.74,25.09 90 top
Q2  44.07,24.53 90 top
Q3  106.68,96.52 0 top
Q4  119.38,96.52 0 top
Q5  129.54,96.52 0 top
R1  9.78,97.31 0 top
R2  9.78,93.76 0 top
R3  9.78,90.21 0 top
R4  9.78,86.66 0 top
R5  9.78,83.11 0 top
R6  4.62,78.29 180 top
R7  53.34,55.88 0 top
R8  35.53,55.88 0 top
R9  35.53,48.26 180 top
R10  37.03,40.26 90 top
R11  46.38,40.26 90 top
R12  114.3,45.72 180 top
R13  119.38,45.72 180 top
R14  127,60.96 0 top
R15  127,55.88 0 top
R16  111.76,55.88 180 top
R17  111.76,60.96 0 top
R18  112.89,81.58 270 top
R19  21.65,48.27 0 top
R20  25.85,48.29 180 top
R21  21.95,63.5 180 top
R22  30.49,63.47 180 top
R23  30.69,48.31 0 top
R24  106.68,88.9 180 top
R25  106.68,104.14 90 top
R26  119.38,88.9 0 top
R27  119.38,104.14 270 top
R28  129.54,88.9 0 top
R29  129.54,104.14 270 top
R30  134.62,76.2 0 top
R31  134.62,71.12 0 top
R32  134.62,66.04 0 top
R33  134.62,55.88 180 top
SPI  68.15,36.12 0 top
U2  9.72,33.29 270 top
U3  44.58,52.4 0 top
U4  20.23,33.29 270 top
X1  24.05,5.81 0 top
X2  54.38,5.81 0 top
X3  103.27,5.81 0 top
X4  133.01,7.07 180 top

### Tracks (layer width: path | path; a pad name or v marks a point on that pad's centre or on a via)
24VIN
  pour Top (no thermals): 16.38,15.67 22.96,15.67 arc90 24.92,17.63 24.92,25.02 arc90 22.96,26.97 4.19,26.97 arc90 1.65,24.43 1.65,10.01 arc90 4.19,7.47 5.08,7.47 arc-90 7.62,4.93 7.62,3.84 arc90 10.16,1.3 11.3,1.3 arc90 13.84,3.84 13.84,13.13 arc-90
  pour Bottom (no thermals): 16.38,15.67 22.96,15.67 arc90 24.87,17.58 24.87,25.07 arc90 22.96,26.97 4.19,26.97 arc90 1.65,24.43 1.65,10.01 arc90 4.19,7.47 5.08,7.47 arc-90 7.62,4.93 7.62,3.84 arc90 10.16,1.3 11.3,1.3 arc90 13.84,3.84 13.84,13.13 arc-90
487-ENABLE  (via drill 0.51)
  Top 0.305: IC3.2 IC3.3 101.77,80.69 v101.8,80.72
  Bottom 0.305: v101.8,80.72 117.37,80.72 145.85,52.25 152.1,52.25 J1.35
+3V3
  Top 1.27: MD$1.2 27.94,67.37 27.94,69.14 19.27,69.14 C2.+ 16.89,70.92 16.89,78.06 MD$2.VCC
+5V
  Top 0.305: R15.2 R14.2 123.78,65.18 103.12,65.18 | R15.2 R33.2 | R16.2 110.76,50.95 C7.1 | IC3.8 103.14,83.23 103.12,83.21 | IC5.6 103.25,76.71 103.12,76.58 | IC2.8 123.14,58.42 124.28,57.28 124.28,54.79 124.89,54.18 127.03,54.18 128,55.15 R15.2 | IC5.18 126.55,85.72 104.14,85.72 | LED1.2 76.71,27.18 75.72,28.17 | IC1.5 42.1,39.91 41.73,40.28 40.39,40.28 38.47,42.21 39.34,43.08 55.4,43.08 55.45,43.03 | R6.3 14.02,78.28 14.48,78.74 | ESTOP.2 8.14,64.69 8.27,64.69
  Top 0.813: DP$1.2 83.69,101.17 93.67,101.17 97.64,105.14 104.14,105.14 | 104.14,105.14 R25.2 | 104.14,105.14 104.14,85.72 103.12,84.71 103.12,83.21 103.12,76.58 103.12,65.18 103.12,63.52 R16.2
  Top 1.016: R25.2 R27.1 R29.1
  Top 1.27: 14.48,68.84 C1.+ | MD$1.1 20.71,67.32 19,65.61 15.67,65.61 14.48,66.8 | DP$1.2 71.14,66.06 66.04,60.96 | SPI.6 MCP.6 73.23,53.85 C3.+ 66.04,46.66 57.43,46.66 55.45,44.68 55.45,43.03 55.45,25.68 61.62,25.68 63.07,27.13 | M1.J2.4 45.72,97.55 45.72,60.96 | X4.1 136.04,9.91 136.04,9.99 135.56,10.47 X4.2 135.53,11.93 135.53,26.64 131.24,30.94 78.49,30.94 75.72,28.17 72.47,24.92 65.28,24.92 63.07,27.13 | 63.07,27.13 I2C.2
  Top 2.54: PS1.3 8.27,64.69 14.48,64.69 14.48,66.8 14.48,68.84 14.48,78.74 14.48,86.36 35.56,86.36 35.56,63.5 38.1,60.96 45.72,60.96 66.04,60.96 67.32,60.96 C3.+
  Bottom 0.305: JP1.2 5.07,96.52 2.54,96.52 2.54,72.32 3.63,71.24 3.63,69.21 ESTOP.2
+24V  (via drill 0.51, 0.51 pad 0.55)
  Top 0.61: U3.6 49.76,51.76
  Top 1.27: 49.76,51.76 v49.76,51.94 53.62,51.94 D1.C | D2.C 35.96,5.12 X1.6 | D3.C 46.78,4.63 X2.2 | R12.2 98.27,45.72 93.34,50.65 93.26,50.56 84.77,50.56 83.67,49.45 83.67,45.31 83.64,45.29 83.64,37.97 83.84,37.77 83.84,35.79 v83.34,35.28
  Top 2.54: v26.87,26.67 26.87,12.7 21.55,12.7 X1.3
  Bottom 1.27: v49.76,51.94 46.88,51.94 46.88,12.7 63.25,12.7 69.93,19.38 69.93,22.08 74.42,26.57 74.62,26.57 v83.34,35.28
  Bottom 2.54: X1.3 21.55,8.61 36.55,8.61 | 36.55,8.61 X1.6 | 36.55,8.61 46.88,8.61 | 46.88,12.7 46.88,8.61 | 46.88,8.61 X2.2 | PS1.1 8.27,44.61 C4.+ 7.48,33.29 | 7.48,33.29 U2.2 | 7.48,33.29 U2.1 9.72,29.13 26.9,29.13 26.9,26.67 v26.87,26.67
  pour Top (no thermals): 10.46,52.14 arc89 8.27,54.29 arc90 5.94,51.97 5.94,44.09 arc-90 4.24,42.39 arc90 1.7,39.85 1.7,31.27 arc90 4.24,28.73 10.98,28.73 arc98 13.49,31.64
  pour Bottom (no thermals): 10.46,52.14 arc89 8.21,54.34 arc90 5.94,52.07 5.94,44.09 arc-90 4.24,42.39 arc90 1.7,39.85 1.7,31.27 arc90 4.24,28.73 10.98,28.73 arc98 13.49,31.64
A  (via drill 0.51)
  Top 0.305: IC3.6 112.89,80.69 R18.2 114.44,80.58 114.94,80.09 114.94,79.2 v114.81,79.07
  Bottom 0.305: v114.81,79.07 114.81,78.23 116.38,76.66 116.38,37.91 130.46,23.83 130.46,11.49 131.48,10.47 131.48,8.95 132.08,8.35 132.75,8.35 132.77,8.33 132.79,8.35 132.92,8.35 133.52,8.95 X4.4
A0
  Top 0.305: IC2.4 115.88,57.92 114.78,56.82 114.78,46.19 R12.1 R13.2 118.53,45.82 C6.1
A1  (via drill 0.51)
  Top 0.305: IC2.5 116.03,57.42 115.24,56.63 115.24,49.89 v115.62,49.51
  Bottom 0.305: v115.62,49.51 93.64,49.51 93.06,50.08 57.7,50.08 50.8,43.18 50.8,22.86 52.78,20.88 ADC.1
A2  (via drill 0.51)
  Top 0.305: IC2.6 122.54,57.42 122.99,56.97 122.99,56.16 122.99,45.85 121.28,44.15 89.97,44.15 85.27,48.84 v85.14,48.84
  Bottom 0.305: v85.14,48.84 57.17,48.84 51.26,42.93 51.26,25.02 53.39,22.89 61.52,22.89 63.07,21.34 ADC.2
A3  (via drill 0.51)
  Top 0.305: IC2.7 122.85,57.92 123.75,57.02 123.75,56.11 123.44,55.8 123.44,45.66 121.42,43.64 89.46,43.64 85.93,47.17 v85.17,47.17
  Bottom 0.305: v85.17,47.17 84.07,48.26 57.43,48.26 57.4,48.28 51.71,42.6 51.71,25.32 53.62,23.42 63.07,23.42 ADC.3
B  (via drill 0.51)
  Top 0.305: IC3.7 112.89,81.96 R18.1 115.54,82.58 116.84,81.28 116.79,81.23 116.79,79.12 v116.84,79.07
  Bottom 0.305: v116.84,79.07 116.84,38.1 132.5,22.44 X4.5
BRAKE1
  Top 1.27: Q1.3 32.26,26.86 D2.A 32.26,4.54 X1.5
BRAKE2
  Top 1.27: Q2.3 43.08,26.3 D3.A 43.08,4.54 X2.1
BRAKE-SIGNAL
  Top 0.305: IC1.2 41.45,42.24 41.63,42.42 54.51,42.42 54.51,25.29 55.82,23.98 71.9,23.98 76.01,19.86 127.01,19.86 134.54,12.33 134.54,10.81 133.52,9.79 133.52,8.95 134.12,8.35 137,8.35 137.6,8.95 137.6,36.88 151.63,50.91 153.39,50.91 J1.36
CE0  (via drill 0.51)
  Top 0.305: SPI.2 67.08,32.11 124.61,32.11 129.9,37.39 129.9,47.4 139.04,56.54 139.62,57.12 141.63,59.13 v142.09,59.13
  Bottom 0.305: v142.09,59.13 149.11,66.16 153.39,66.16 J1.24
CE1  (via drill 0.51)
  Top 0.305: v109.22,37.49 109.22,35.76 110.26,34.72 122.73,34.72 125.65,37.64 125.65,43.87 v125.55,43.97 | v140.23,56.13 142.98,58.88 v144.81,58.88
  Bottom 0.305: SPI.1 62.76,38.35 108.36,38.35 v109.22,37.49 | v125.55,43.97 128.07,43.97 v140.23,56.13 | v144.81,58.88 149.54,63.62 152.66,63.62 152.67,63.6 153.42,63.6 154.68,64.87 J1.26
GND  (via drill 0.3 pad 0.55, 0.51)
  Top 0.305: IC2.3 115.34,58.42 114.3,57.38 114.3,53.34 112.61,51.65 C7.2 | IC5.3 IC5.4 119.18,79.25 117.42,77.5 107.47,77.5 IC3.5 108.34,79.42 v108.58,79.17 | IC5.9 115.04,72.9 v114.99,72.85 | IC1.3 39.79,42.24 v39.73,42.24 | JP2.2 8.76,86.59 R4.1 | U3.4 42.02,49.64 v40.64,48.26 | R20.1 28.03,48.29 29.01,47.31 32.37,47.31 32.54,47.49 32.54,48.26 | 34.48,51.88 32.54,49.94 32.54,48.26 | 34.48,51.88 C5.2 | 34.48,51.88 34.58,51.78 R9.2 32.54,48.26 | v18.01,56.24 20.68,56.24 20.86,56.42 | IC4.15 24.02,56.21 v24.16,56.08
  Top 0.406: C10.2 26.84,62.01 27.41,61.44 v27.41,59.87 | IC4.12 20.55,56.74 20.86,56.42 IC4.15 | R22.1 31.49,61.92 v29.44,59.87 | C8.2 13.32,48.23 C9.2
  Top 1.27: MD$2.GND 18.79,71.57 C2.- 28.46,71.38 30.38,69.47 30.38,67.38 MD$1.3 | PS1.2 14.76,55.83 v14.76,56.24 | Q1.2 35.31,31.19 v38.73,31.19 39.49,31.19 Q2.2 | v12.72,52.22 12.72,48.9 C9.2
  Top 2.54: X1.2 16.55,6.11 16.56,6.12 16.56,3.76 17.78,2.54
  Bottom 1.778: PS1.2 3.92,55.83
  Bottom 2.54: 3.92,55.83 C4.- | X1.2 16.55,7.62 | 16.55,7.62 17.78,7.62 | 16.55,7.62 16.46,7.62 16.46,2.29
  other vias: 15.98,56.24 12.73,60.02 14.76,60.02 12.73,57.99 14.76,57.99 12.73,56.24 12.73,54.25 14.76,54.25 14.76,52.22 26.19,56.08 29.44,57.84 27.41,57.84 29.44,56.08 27.41,56.08 29.44,54.1 27.41,54.1 29.44,52.07 27.41,52.07 32.82,40.87 34.8,42.16 33.68,46.08 38.61,46.15 39.19,55.85 106.68,63.5 106.5,67.21 145.41,65.48 142.65,62.99 157.66,27.61 143,36.45 143.05,31.95 143.05,27.53 134.52,33.5 134.47,37.41 134.34,41 86.36,22.86 99.06,22.86 119.38,22.86 127,22.86 149.81,61.42 147.57,58.37 142.24,53.34 134.62,81.28 139.7,73.66 147.32,78.74 147.32,86.36 39.37,23.22 39.29,20.85
  pour Top (no thermals): 19.79,57 19.79,55.42 15.24,55.42 15.24,51.18 12.22,51.18 12.22,60.91 15.27,60.91 15.27,56.97
  pour Top (no thermals): 22.38,56.9 22.38,55.32 26.92,55.32 26.92,51.08 29.95,51.08 29.95,60.81 26.9,60.81 26.9,56.87
  pour Bottom (no thermals): 19.79,57 19.79,55.42 15.24,55.42 15.24,51.18 12.22,51.18 12.22,60.91 15.27,60.91 15.27,56.97
  pour Bottom (no thermals): 22.38,56.9 22.38,55.32 26.92,55.32 26.92,51.08 29.95,51.08 29.95,60.81 26.9,60.81 26.9,56.87
  pour Bottom (isolate 0.305): 0.94,116.84 165.1,116.84 165.1,-2.54 14.78,-2.54 14.78,14.5 29.36,14.5 29.36,61.9 15.11,61.9 15.11,55.88 15.24,55.88 15.24,54.81 0.94,54.81
  pour Top (isolate 0.305): 167.64,-2.54 167.64,111.76 -5.08,111.76 -5.08,54.91 15.06,54.91 15.06,62.15 15.34,62.15 28.73,62.15 28.73,50.9 43.84,50.9 43.84,51.54 52.96,51.54 52.96,44.58 29.95,44.58 29.95,42.57 29.95,14.27 14.94,14.27 14.94,-2.54 18.72,-2.54 162.56,-2.54
M3  (via drill 0.51)
  Top 0.305: IC5.13 127.94,76.71 127.58,76.35 127.58,71.39 128.68,70.3 128.68,67.26 127.31,65.89 126.64,65.89 v126.52,65.76 | v121.92,35.56 121.13,36.35 v110.85,36.35
  Bottom 0.305: v126.52,65.76 125.3,66.98 120.66,66.98 119.38,65.7 119.38,45.21 122.68,41.91 122.68,36.32 v121.92,35.56 | MCP.1 65.3,38.96 109.83,38.96 110.85,37.95 v110.85,36.35 111.51,35.69 112.62,35.69 112.62,26.39 X3.1
M4  (via drill 0.51)
  Top 0.305: IC5.14 127.28,77.98 126.9,77.6 126.9,71.43 128.22,70.11 128.22,68 126.29,68 v126.14,67.84 | v121.31,37.31 120.5,38.12 v112.12,38.12
  Bottom 0.305: v126.14,67.84 120.88,67.84 118.69,65.66 118.69,45.25 122.2,41.74 122.2,37.36 122.22,37.34 121.34,37.34 v121.31,37.31 | MCP.2 67.18,39.62 110.06,39.62 111.56,38.12 v112.12,38.12 113.28,36.96 113.28,22.05 X3.2
M5  (via drill 0.51)
  Top 0.305: IC5.15 126.39,79.25 126.14,78.99 126.14,71.55 127.23,70.46 127.23,69.29 127.38,69.14 127.38,68.91 v127.46,68.83 | v121.06,39.42 112.72,39.42 v112.29,39.85
  Bottom 0.305: v127.46,68.83 121.11,68.83 118.24,65.96 118.24,45.06 121.74,41.55 121.74,40.11 v121.06,39.42 | MCP.3 68.99,40.36 111.78,40.36 v112.29,39.85 113.89,38.25 113.89,17.66 X3.3
M6  (via drill 0.51)
  Top 0.305: IC5.16 126.47,80.52 125.45,79.5 125.45,71.59 125.83,71.21 125.83,70.66 v126.47,70.03 | v119.38,40.64 113.84,40.64 v113.84,40.39
  Bottom 0.305: v126.47,70.03 121.54,70.03 117.75,66.24 117.75,43.18 119.38,43.18 v119.38,40.64 | MCP.4 70.76,41.12 112.9,41.12 113.64,40.39 v113.84,40.39 113.84,39.98 114.5,39.32 114.35,39.17 114.35,13.12 X3.4
M7  (via drill 0.51)
  Top 0.305: IC5.17 126.8,81.79 124.64,79.63 124.64,71.32 v125.07,70.89 | v118.24,41.78 115.19,41.78 v115.16,41.81
  Bottom 0.305: v125.07,70.89 121.69,70.89 117.3,66.5 117.3,42.72 v118.24,41.78 | MCP.5 72.62,41.81 v115.16,41.81 115.16,8.93 X3.5
MISO  (via drill 0.51)
  Top 0.305: SPI.4 70.99,33.27 123.29,33.27 127.94,37.92 127.94,48.49 131.75,52.3 v132.38,52.3 | v135.33,59.94 138.58,63.2 v138.76,63.2
  Bottom 0.305: v135.33,59.94 132.38,57 132.38,54.75 132.49,54.65 132.49,54.02 132.38,53.91 v132.38,52.3 | v138.76,63.2 145.56,69.99 J1.21
MOSI  (via drill 0.51)
  Top 0.305: SPI.3 69.01,32.72 123.95,32.72 128.88,37.64 128.88,47.17 134.29,52.58 v134.29,53.72 | v137.11,59.03 140.18,62.1 v140.18,65.84
  Bottom 0.305: v134.29,53.72 134.29,56.21 v137.11,59.03 | v140.18,65.84 146.88,72.53 J1.19
N$2
  Top 0.305: IC5.12 133.67,75.44 R30.1
N$3
  Top 0.305: IC5.11 133.67,74.17 R31.1
N$4  (via drill 0.3 pad 0.55, 0.51 pad 0.55)
  Top 1.27: v16.61,60.02 16.61,62.41 10.56,62.41 10.56,57.48 v10.57,57.48 | R19.1 20.64,48.26 17.78,48.26
  Bottom 1.27: v10.57,57.48 10.57,48.28 16.92,48.28 16.92,52.22 v16.61,52.22
  other vias: 16.61,57.99 18.64,60.02 18.64,52.22 16.61,54.25
  pour Top (no thermals): 16.08,51.64 16.08,54.91 19.2,54.91 19.2,51.64
  pour Top (no thermals): 16.08,57.45 16.08,60.73 19.2,60.73 19.2,57.45
  pour Bottom (no thermals): 16.08,57.45 16.08,60.73 19.2,60.73 19.2,57.45
  pour Bottom (no thermals): 16.08,51.64 16.08,54.91 19.2,54.91 19.2,51.64
  pour Top (no thermals): 16.08,51.66 15.29,49.58 15.29,33.58 arc90 17.83,31.04 24.59,31.04 arc90 27.13,33.58 27.13,42.56 arc89 24.65,45.1 23.68,45.12 arc-89 19.18,49.75 19.18,51.69 16.08,51.69
  pour Bottom (no thermals): 16.08,51.66 15.29,49.58 15.29,33.58 arc90 17.83,31.04 24.59,31.04 arc90 27.13,33.58 27.13,42.56 arc89 24.65,45.1 23.68,45.12 arc-89 19.18,49.75 19.18,51.69 16.08,51.69
N$5
  Top 0.305: R10.2 38.82,41.21 IC1.4 40.8,38.42 41.45,37.77 42.94,37.77 R11.2
N$6  (via drill 0.51)
  Top 0.305: Q4.2 120.33,88.95 R26.2 121.41,89.93 v121.41,91.67
  Bottom 0.305: v121.41,91.67 150.78,91.67 J1.5
N$7
  Top 0.305: Q2.1 46.35,39.28 R11.1
N$8
  Top 0.305: Q1.1 R10.1
N$9  (via drill 0.51)
  Top 0.305: Q3.2 107.63,88.95 R24.1 109.98,88.9 v110.01,88.88
  Bottom 0.305: v110.01,88.88 113.98,92.85 J1.3
N$12
  Top 0.305: IC5.10 129.21,66.04 R32.1
N$13
  Top 0.406: IC4.2 19.89,51.23 22.65,48.47 R19.2 24.83,48.27 R20.2
N$14
  Top 0.406: IC4.9 22.5,61.96 R21.2 20.95,64.61 21.51,65.18 27.78,65.18 R22.2
N$15
  Top 0.305: J1.11 143.37,82.69 137.16,88.9 R28.2 130.49,88.95 Q5.2
N$16
  Top 0.406: IC4.13 19.89,61.82 19.58,62.13 19.58,64.47 20.95,65.84 31.8,65.84 32.79,64.85 32.79,51.28 31.85,50.34 31.85,48.48 R23.2
N$17
  Top 0.406: IC4.6 22.5,51.05 25.15,51.05 26.29,49.91 29.16,49.91 29.16,48.84 R23.1
N$20
  Top 0.305: IC2.2 114.19,58.92 112.76,57.49 R16.1
N$21
  Top 0.305: IC2.1 114.3,59.42 R17.2
N$34  (via drill 0.51)
  Top 0.305: LED1.1 75.18,21.34 76.2,20.32 78.74,20.32 81.1,22.68 81.1,26.01 81.81,26.72 133.43,26.72 v133.63,26.52 | v132.99,63.14 135.43,63.14 137.03,64.75 137.03,74.74 R30.2
  Bottom 0.305: v133.63,26.52 133.63,27.88 124.33,37.17 124.33,44.3 130.45,50.42 130.45,50.67 130.5,50.72 130.5,61.57 132.08,63.14 v132.99,63.14
N$35  (via drill 0.51)
  Top 0.305: LED1.3 82.53,29.01 128.52,29.01 v129.03,29.52 | v129.97,66.8 131.75,68.58 134.62,68.58 135.57,69.53 R31.2
  Bottom 0.305: v129.03,29.52 129.03,30.89 123.29,36.63 123.29,44.55 129.54,50.8 129.54,66.37 v129.97,66.8
N$36  (via drill 0.51)
  Top 0.305: LED1.4 79.5,25.2 82.68,28.37 129.77,28.37 v130.25,27.89 | v131.39,64.54 134.07,64.54 R32.2
  Bottom 0.305: v130.25,27.89 130.25,30.43 123.85,36.83 123.85,44.46 130,50.61 130,63.42 131.12,64.54 v131.39,64.54
N$37
  Top 0.305: ESTOP.4 6.8,71.94 3.4,75.34 3.4,81.28 3.4,82.35 3.4,89.28 5.05,90.93 8.11,90.93 R3.1
N$38
  Top 0.305: ESTOP.3 2.94,73.36 2.94,90.29 4.7,92.05 7.12,92.05 R2.1
N$39
  Top 0.305: ESTOP.1 2.48,99 2.54,99.06 7.08,99.06 R1.1
N$40  (via drill 0.51)
  Top 0.305: R3.2 30.14,90.21 v30.28,90.07
  Bottom 0.305: v30.28,90.07 35.22,95.01 M1.J1.5
N$41
  Top 0.305: R4.2 12.55,86.66 13.83,87.94 38.21,87.94 M1.J1.8 37.7,86.33 37.7,84.41 38.32,83.79 39.19,83.79 40.27,84.87 40.27,89.91 39.19,90.99 35.16,90.99 30.46,95.68 8.15,95.68 6.82,94.34 JP1.1
N$42  (via drill 0.51)
  Top 0.305: R2.2 10.95,93.98 29.39,93.98 v33.02,90.35
  Bottom 0.305: v33.02,90.35 35.14,92.47 M1.J1.6
N$43
  Top 0.305: R1.2 9.56,96.14 7.96,96.14 7.24,95.41 4.23,95.41 3.6,94.79 3.6,93.9 4.23,93.28 6.64,93.28 7.26,93.9 7.26,94.14 8.34,95.22 30.27,95.22 34.97,90.53 38.15,90.53 M1.J1.7
N$44
  Bottom 0.305: R6.2 12.7,83.82 32.48,83.82 34.56,85.91 50.4,85.91 M1.J2.10
N$53
  Top 0.406: C5.1 36.38,53.03 U3.2
N$55
  Top 0.406: R9.1 38.1,50.8 U3.3
N$57
  Top 0.406: R8.2 36.48,54.3 U3.1
N-D6  (via drill 0.51)
  Top 0.305: U3.8 45.67,54.3 44.81,53.44 | 44.81,53.44 44.81,53.34 44.81,46.58 v44.76,46.53 | v43.99,41.12 43.18,41.94 42.34,41.94 42.1,41.7 IC1.1 | JP2.3 7.01,89.13 8.28,87.86 13.1,87.86 13.64,88.39 38.26,88.39 38.32,88.45 39.19,88.45 39.81,87.83 39.81,86.95 38.76,85.89 M1.J1.9 | 44.81,53.44 44.81,56.01 41.43,59.38 37.45,59.38 33.58,63.25 33.58,82.07 32.99,82.65 v32.99,83.26
  Top 0.406: R7.1 U3.8
  Bottom 0.305: v44.76,46.53 44.76,41.88 v43.99,41.12 | v32.99,83.26 34.58,84.85 M1.J1.9
N-D7  (via drill 0.51)
  Top 0.305: Q5.3 R29.2 130.57,103.14 132,104.57 132,105.84 130.63,107.21 97.84,107.21 93.28,102.65 56.27,102.65 55.14,101.52 47.55,101.52 42.57,96.55 42.57,86.13 M1.J1.10 39.79,81.28 v43.18,81.28 | JP2.1 7.89,84.05 R5.1
  Bottom 0.305: JP2.1 5.43,79.81 5.87,79.38 5.87,77.22 7.47,75.62 30.5,75.62 36.3,69.82 36.3,66.06 37.92,64.44 56.64,64.44 55.99,65.09 55.99,69.11 54.43,70.67 50.41,70.67 41.1,79.98 42.39,81.28 v43.18,81.28
N-D8
  Bottom 0.305: MD$2.CE 22.73,78.82 37.8,78.82 M1.J1.11
N-D10
  Bottom 0.305: MD$2.CSN 22.37,79.96 23.89,81.48 36.42,81.48 38.32,83.37 39.19,83.37 40.64,81.92 40.64,76.2 39.13,74.69 M1.J1.13
N-D11
  Bottom 0.305: MD$2.MOSI 24.91,79.96 25.97,81.02 39.01,81.02 39.81,80.21 39.81,79.33 38.84,78.36 37.11,78.36 37.03,78.28 37.03,73.87 M1.J1.14
N-D12
  Bottom 0.305: M1.J1.15 30.95,77.42 MD$2.MISO
N-D13
  Bottom 0.305: MD$2.SCK 25.22,76.07 31.29,76.07 37.01,70.36 37.01,68.14 36.76,67.9 36.76,66.25 37.93,65.08 49.18,65.08 53.17,69.06 53.45,69.06 M1.J2.15
PI-3.3V
  Top 0.305: Q3.1 105.73,88.95 | 105.73,88.95 R24.2 | 128.55,86.36 134.62,86.36 145.91,75.07 J1.17 152.14,75.85 153.39,77.09 153.39,93.37 152.14,94.61 J1.1 | 128.55,86.36 118.36,86.36 | 118.36,86.36 106.68,86.36 105.73,87.31 105.73,88.95 | Q4.1 118.43,88.95 R26.1 118.38,86.38 118.36,86.36 | Q5.1 128.59,88.95 R28.1 128.54,86.37 128.55,86.36
PI-5V+  (via drill 0.3 pad 0.55, 0.51 pad 0.55)
  Top 0.406: v23.44,60.2 23.44,63.01 R21.1 | v25.48,60.2 25.48,63.16 C10.1
  Bottom 2.54: v23.44,60.2 23.44,63.5 35.56,63.5 35.56,60.96 | 35.56,60.96 35.56,58.42 43.16,58.42 | v133.76,99.06 154.68,99.06 J1.2 J1.4 156.35,92.85 156.36,92.86 156.36,100.11 154.94,101.54 142.6,101.54 142.55,101.49 139.34,101.49 139.23,101.6 133.76,101.6 | v133.76,99.06 v101.5,99.06 | v101.5,99.06 91.44,99.06 91.44,60.96 | 91.44,60.96 91.44,58.42 v76.2,58.42 | v76.2,58.42 64.06,58.42 | 64.06,58.42 43.16,58.42 | v133.76,99.06 133.76,101.6 | 101.5,101.6 v101.5,99.06 | 133.76,101.6 101.5,101.6 | v76.2,58.42 76.2,60.96 | 76.2,60.96 35.56,60.96 | C11.+ 64.06,58.42 | 76.2,60.96 88.9,60.96 | 88.9,60.96 91.44,60.96 | 101.5,101.6 93.44,101.6 93.38,101.54 91.44,101.54 88.9,99 88.9,60.96 | v23.44,52.27 29.72,46 29.72,37.82 40.36,37.82 42.11,39.57 42.11,46.55 43.16,47.59 43.16,58.42
  other vias: 25.48,58.17 25.48,54.31 25.48,52.27
  pour Top (no thermals): 22.96,57.45 22.96,60.73 26.09,60.73 26.09,57.45
  pour Bottom (no thermals): 22.96,57.45 22.96,60.73 26.09,60.73 26.09,57.45
  pour Top (no thermals): 22.96,51.66 22.96,54.94 26.09,54.94 26.09,51.66
  pour Bottom (no thermals): 22.96,51.66 22.96,54.94 26.09,54.94 26.09,51.66
RX3
  Top 0.305: X2.6 69.96,7.62 117.5,7.62 117.55,7.67 119.23,5.99 119.38,5.99 123.99,1.38 143.62,1.38 158.85,16.61 158.85,23.52 154.83,27.54 J2.9 157.48,30.38 157.48,54.49 155.93,56.05 154.17,56.05 153.44,56.77 153.44,58.53 J1.29
RX5  (via drill 0.51)
  Top 0.305: IC3.1 101.73,83.23 v101.78,83.19 | v143.15,57 145.4,54.75 J1.33
  Bottom 0.305: v101.78,83.19 116.28,83.19 140.37,59.09 140.41,59.05 142.47,57 v143.15,57
SCL  (via drill 0.51)
  Top 0.305: IC2.10 124.46,59.42 R14.1 125.83,60.96 v122.73,64.06 | R27.2 Q4.3 | Q4.3 120.67,97.62 122.48,95.81 v122.48,87.66 | IC5.1 123.57,83.06 v123.98,82.65 123.98,66.52 v124.46,66.04 | v101.6,96.52 81.58,96.52 DP$1.3 73.68,63.48 81.28,55.88 v81.28,35.56 | v110.44,96.52 113.67,96.52 114.78,97.64 114.8,97.62 Q4.3
  Bottom 0.305: v122.48,87.66 122.48,84.15 v123.98,82.65 | v124.46,66.04 122.73,64.31 v122.73,64.06 | v101.6,96.52 v110.44,96.52 | v81.28,35.56 74.22,28.5 I2C.4
SCLK  (via drill 0.51)
  Top 0.305: SPI.5 70.69,35.23 72.06,33.86 122.83,33.86 127,38.02 127,50.8 130.53,54.33 v131.72,54.33 | v133.96,61.57 134.65,61.57 140.53,67.45 J1.23
  Bottom 0.305: v131.72,54.33 131.72,59.33 v133.96,61.57
SDA  (via drill 0.51)
  Top 0.305: IC2.9 124.44,58.92 125.39,57.98 | R15.1 126,57.36 125.39,57.98 | R25.1 Q3.3 108.12,97.62 109.22,96.52 v109.22,93.98 109.22,93.47 v115.11,87.58 | v101.6,93.98 81.58,93.98 DP$1.4 76.2,88.6 76.2,61.61 81.74,56.07 81.74,37.8 v82.37,37.16 | v116.38,84.43 116.38,84.38 118.97,81.79 IC5.2 121.49,81.79 122.81,80.47 122.81,66.95 v121.94,66.09 | v126.39,58.88 125.49,57.98 125.39,57.98
  Bottom 0.305: v101.6,93.98 v109.22,93.98 | v116.38,84.43 116.38,86.31 v115.11,87.58 | v82.37,37.16 81.71,36.5 80.82,36.5 74.8,30.48 67.11,30.48 65.61,28.98 I2C.3 | v121.94,66.09 121.94,63.32 v126.39,58.88
SOFT-ESTOP
  Top 0.305: R33.1 139.95,60.21 149.22,60.21 151.71,57.73 | 151.71,57.73 J1.31 | J2.14 J2.13 156.57,34.55 156.57,52.09 155.2,53.45 154.22,53.45 153.39,54.28 153.39,55.27 152.66,55.99 152.4,55.99 151.71,56.69 151.71,57.73
SOLENOID-
  Top 1.27: X1.4 26.55,7.87 29.57,7.87 29.57,44.25 48.26,44.25 48.26,48.26
  pour Top: 46.25,50.75 46.25,47.88 arc90 47.52,46.61 50.95,46.61 arc90 52.22,47.88 52.22,50.55 52.22,50.75
TX3  (via drill 0.51)
  Top 0.305: X2.5 65.62,8.28 118.01,8.28 122.4,3.89 144.32,3.89 158.39,17.96 158.39,20.69 155.3,23.79 153.7,23.79 J2.8 153.7,26.61 153.7,28.2 154.37,28.86 155.32,28.86 157.02,30.57 157.02,53.49 v156.62,53.9
  Bottom 0.305: v156.62,53.9 156.62,85.06 155.2,86.47 153.44,86.47 J1.7
TX5  (via drill 0.51)
  Top 0.305: IC3.4 100.92,79.42 v101.6,78.74
  Bottom 0.305: v101.6,78.74 101.6,79.85 101.04,80.41 101.04,81.04 101.49,81.48 102.12,81.48 102.32,81.28 117.46,81.28 142.7,56.05 153.44,56.05 J1.32

### Text on the board
tNames: JLCJLCJLCJLC | M3 | M4 | M5 | M6 | M7 | 5V | GND | CE1 | CE0 | MOSI | MISO | SCK | 5V | GND | GND | 5V | SDA | SCL | ROBO CLAW | SCENERY ROBOT V4.0 2020 | A1 | A2 | A3 | GND | INPUT | SOLENOID | BRAKE1 | BRAKE2 | SPARE | MOTOR | PORT EXPANDER | +24VIN | GND | SLND+ | SLND- | BRAKE- | BRAKE+ | BRAKE- | BRAKE+ | GND | GND | TX | RX | MCP3 | MCP4 | MCP5 | MCP6 | MCP7 | GND | MODBUS | MODBUS
bNames: Scenery Robot Team 2020 / Andy Carluccio / Joe Karaki / Sai Raj / Eric Kim / Zoe Lee